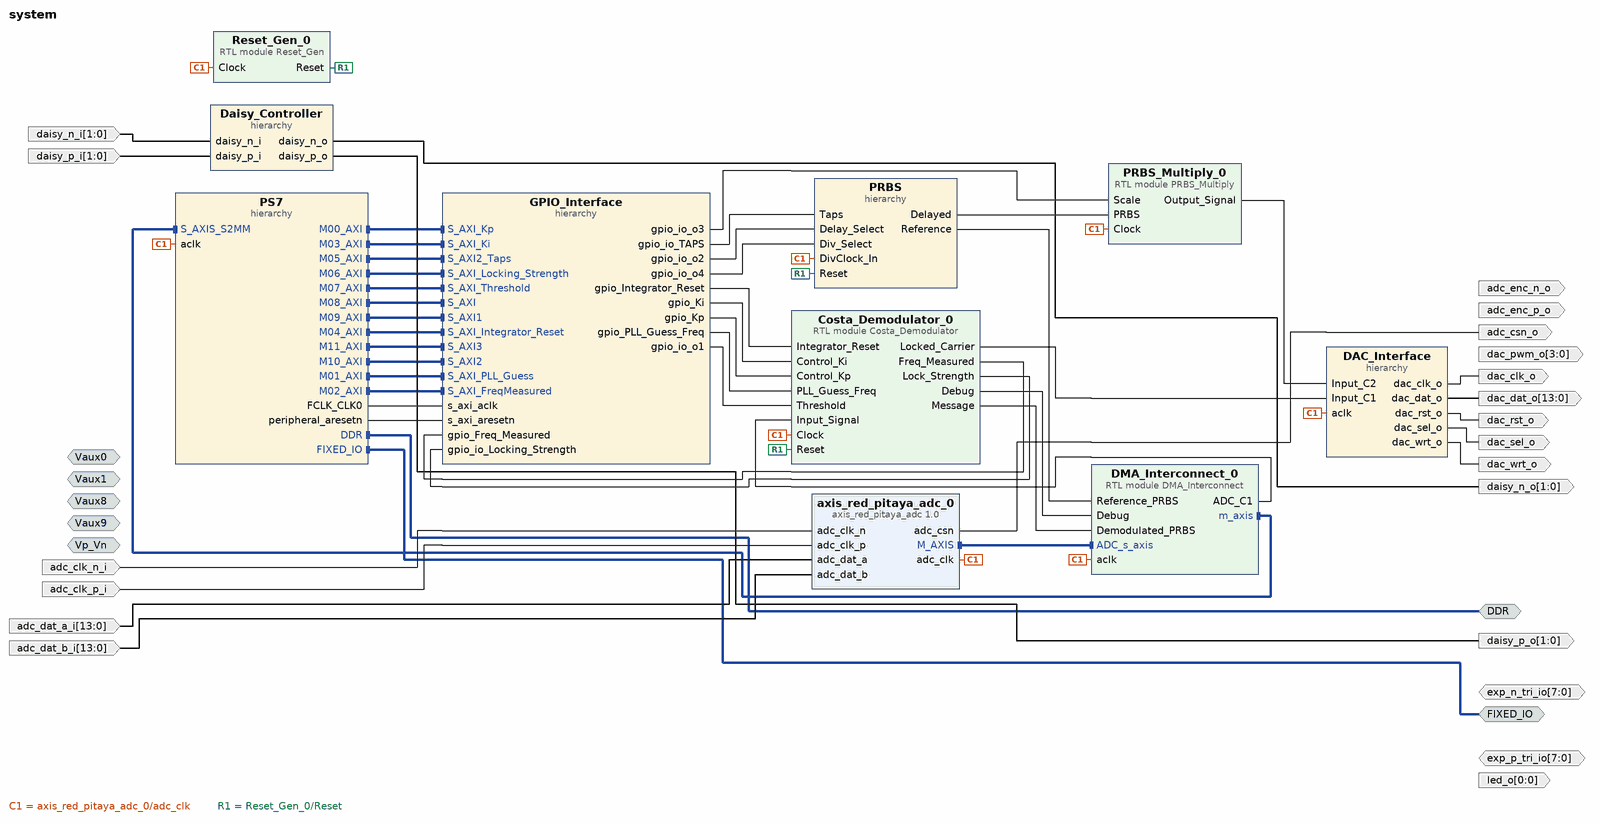
[diagram p0: block diagram of the top level]
# Vivado block design system, xc7z010clg400-1, Vivado 2022.2
create_bd_design system

create_bd_intf_port -mode Slave -vlnv xilinx.com:interface:diff_analog_io_rtl:1.0 Vp_Vn
create_bd_intf_port -mode Slave -vlnv xilinx.com:interface:diff_analog_io_rtl:1.0 Vaux0
create_bd_intf_port -mode Slave -vlnv xilinx.com:interface:diff_analog_io_rtl:1.0 Vaux1
create_bd_intf_port -mode Slave -vlnv xilinx.com:interface:diff_analog_io_rtl:1.0 Vaux9
create_bd_intf_port -mode Slave -vlnv xilinx.com:interface:diff_analog_io_rtl:1.0 Vaux8
create_bd_intf_port -mode Master -vlnv xilinx.com:interface:ddrx_rtl:1.0 DDR
create_bd_intf_port -mode Master -vlnv xilinx.com:display_processing_system7:fixedio_rtl:1.0 FIXED_IO
create_bd_port -dir I -from 13 -to 0 adc_dat_b_i
create_bd_port -dir I adc_clk_p_i
create_bd_port -dir I adc_clk_n_i
create_bd_port -dir O adc_enc_p_o
create_bd_port -dir O adc_enc_n_o
create_bd_port -dir O adc_csn_o
create_bd_port -dir O -from 13 -to 0 dac_dat_o
create_bd_port -dir O dac_clk_o
create_bd_port -dir O dac_rst_o
create_bd_port -dir O dac_sel_o
create_bd_port -dir O dac_wrt_o
create_bd_port -dir O -from 3 -to 0 dac_pwm_o
create_bd_port -dir IO -from 7 -to 0 exp_p_tri_io
create_bd_port -dir IO -from 7 -to 0 exp_n_tri_io
create_bd_port -dir O -from 1 -to 0 daisy_p_o
create_bd_port -dir O -from 1 -to 0 daisy_n_o
create_bd_port -dir I -from 1 -to 0 daisy_p_i
create_bd_port -dir I -from 1 -to 0 daisy_n_i
create_bd_port -dir O -from 0 -to 0 led_o
create_bd_port -dir I -from 13 -to 0 adc_dat_a_i

create_bd_cell -type hier PS7
create_bd_cell -type hier Daisy_Controller
create_bd_cell -type ip -vlnv pavel-demin:user:axis_red_pitaya_adc:1.0 axis_red_pitaya_adc_0
create_bd_cell -type hier DAC_Interface
create_bd_cell -type hier GPIO_Interface
create_bd_cell -type hier PRBS
create_bd_cell -type module -reference DMA_Interconnect DMA_Interconnect_0
create_bd_cell -type module -reference PRBS_Multiply PRBS_Multiply_0
create_bd_cell -type module -reference Reset_Gen Reset_Gen_0
create_bd_cell -type module -reference Costa_Demodulator Costa_Demodulator_0
set_property -dict {CONFIG.RAM_Size 12} [get_bd_cells Costa_Demodulator_0]

# ---- hierarchy /PS7 ----
current_bd_instance /PS7
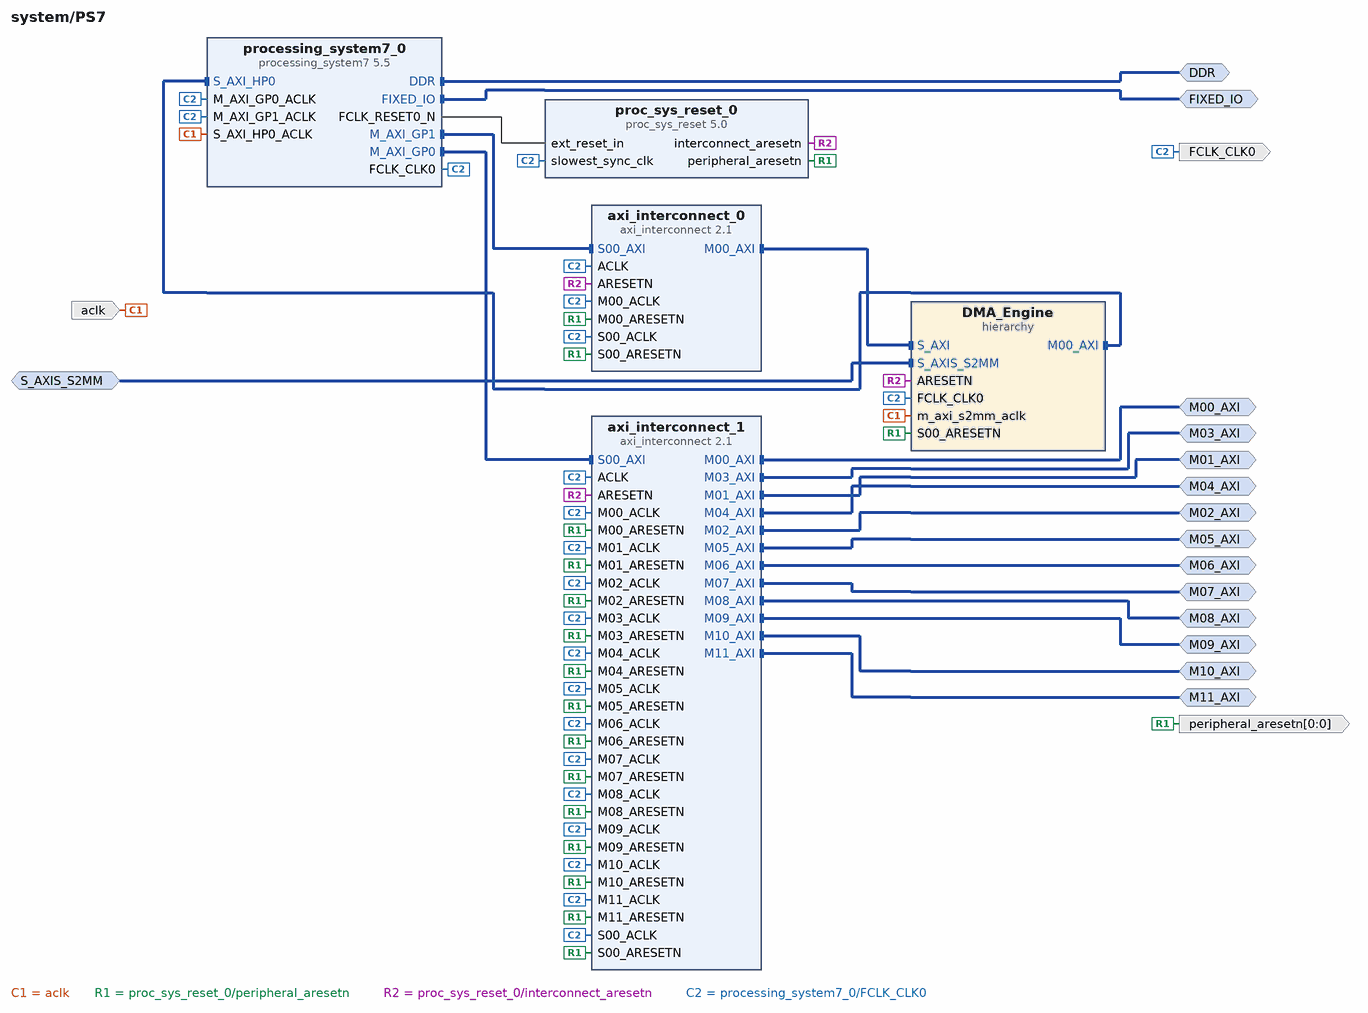
[diagram p1: block diagram inside /PS7]
create_bd_intf_pin -mode Master -vlnv xilinx.com:interface:ddrx_rtl:1.0 DDR
create_bd_intf_pin -mode Master -vlnv xilinx.com:display_processing_system7:fixedio_rtl:1.0 FIXED_IO
create_bd_intf_pin -mode Master -vlnv xilinx.com:interface:aximm_rtl:1.0 M03_AXI
create_bd_intf_pin -mode Master -vlnv xilinx.com:interface:aximm_rtl:1.0 M00_AXI
create_bd_intf_pin -mode Master -vlnv xilinx.com:interface:aximm_rtl:1.0 M01_AXI
create_bd_intf_pin -mode Master -vlnv xilinx.com:interface:aximm_rtl:1.0 M02_AXI
create_bd_intf_pin -mode Slave -vlnv xilinx.com:interface:axis_rtl:1.0 S_AXIS_S2MM
create_bd_intf_pin -mode Master -vlnv xilinx.com:interface:aximm_rtl:1.0 M04_AXI
create_bd_intf_pin -mode Master -vlnv xilinx.com:interface:aximm_rtl:1.0 M05_AXI
create_bd_intf_pin -mode Master -vlnv xilinx.com:interface:aximm_rtl:1.0 M06_AXI
create_bd_intf_pin -mode Master -vlnv xilinx.com:interface:aximm_rtl:1.0 M07_AXI
create_bd_intf_pin -mode Master -vlnv xilinx.com:interface:aximm_rtl:1.0 M08_AXI
create_bd_intf_pin -mode Master -vlnv xilinx.com:interface:aximm_rtl:1.0 M09_AXI
create_bd_intf_pin -mode Master -vlnv xilinx.com:interface:aximm_rtl:1.0 M10_AXI
create_bd_intf_pin -mode Master -vlnv xilinx.com:interface:aximm_rtl:1.0 M11_AXI
create_bd_pin -dir O -type clk FCLK_CLK0
create_bd_pin -dir O -from 0 -to 0 -type rst peripheral_aresetn
create_bd_pin -dir I -type clk aclk

create_bd_cell -type ip -vlnv xilinx.com:ip:processing_system7:5.5 processing_system7_0
set_property -dict [list \
  CONFIG.PCW_APU_PERIPHERAL_FREQMHZ 666.666666 \
  CONFIG.PCW_ENET0_ENET0_IO {MIO 16 .. 27} \
  CONFIG.PCW_ENET0_GRP_MDIO_ENABLE 1 \
  CONFIG.PCW_ENET0_GRP_MDIO_IO EMIO \
  CONFIG.PCW_ENET0_PERIPHERAL_ENABLE 1 \
  CONFIG.PCW_ENET0_RESET_ENABLE 0 \
  CONFIG.PCW_ENET_RESET_ENABLE 1 \
  CONFIG.PCW_ENET_RESET_SELECT {Share reset pin} \
  CONFIG.PCW_EN_CLK1_PORT 1 \
  CONFIG.PCW_EN_RST1_PORT 1 \
  CONFIG.PCW_FCLK1_PERIPHERAL_CLKSRC {DDR PLL} \
  CONFIG.PCW_FCLK_CLK1_BUF TRUE \
  CONFIG.PCW_FPGA0_PERIPHERAL_FREQMHZ 125 \
  CONFIG.PCW_FPGA1_PERIPHERAL_FREQMHZ 150 \
  CONFIG.PCW_FPGA3_PERIPHERAL_FREQMHZ 200 \
  CONFIG.PCW_FPGA_FCLK1_ENABLE 1 \
  CONFIG.PCW_GPIO_MIO_GPIO_ENABLE 1 \
  CONFIG.PCW_GPIO_MIO_GPIO_IO MIO \
  CONFIG.PCW_GPIO_PERIPHERAL_ENABLE 1 \
  CONFIG.PCW_I2C0_GRP_INT_ENABLE 0 \
  CONFIG.PCW_I2C0_I2C0_IO {MIO 50 .. 51} \
  CONFIG.PCW_I2C0_PERIPHERAL_ENABLE 1 \
  CONFIG.PCW_I2C_PERIPHERAL_FREQMHZ 111.111115 \
  CONFIG.PCW_I2C_RESET_ENABLE 1 \
  CONFIG.PCW_I2C_RESET_SELECT {Share reset pin} \
  CONFIG.PCW_IMPORT_BOARD_PRESET cfg/red_pitaya.xml \
  CONFIG.PCW_PRESET_BANK1_VOLTAGE {LVCMOS 2.5V} \
  CONFIG.PCW_QSPI_GRP_SINGLE_SS_ENABLE 1 \
  CONFIG.PCW_QSPI_GRP_SINGLE_SS_IO {MIO 1 .. 6} \
  CONFIG.PCW_QSPI_PERIPHERAL_ENABLE 1 \
  CONFIG.PCW_QSPI_PERIPHERAL_FREQMHZ 125 \
  CONFIG.PCW_QSPI_QSPI_IO {MIO 1 .. 6} \
  CONFIG.PCW_SD0_GRP_CD_ENABLE 1 \
  CONFIG.PCW_SD0_GRP_CD_IO {MIO 46} \
  CONFIG.PCW_SD0_GRP_WP_ENABLE 1 \
  CONFIG.PCW_SD0_GRP_WP_IO {MIO 47} \
  CONFIG.PCW_SD0_PERIPHERAL_ENABLE 1 \
  CONFIG.PCW_SD0_SD0_IO {MIO 40 .. 45} \
  CONFIG.PCW_SDIO_PERIPHERAL_FREQMHZ 100 \
  CONFIG.PCW_SINGLE_QSPI_DATA_MODE x4 \
  CONFIG.PCW_SPI0_PERIPHERAL_ENABLE 1 \
  CONFIG.PCW_SPI0_SPI0_IO EMIO \
  CONFIG.PCW_SPI1_PERIPHERAL_ENABLE 1 \
  CONFIG.PCW_SPI1_SPI1_IO {MIO 10 .. 15} \
  CONFIG.PCW_TTC0_PERIPHERAL_ENABLE 1 \
  CONFIG.PCW_TTC0_TTC0_IO EMIO \
  CONFIG.PCW_UART0_PERIPHERAL_ENABLE 1 \
  CONFIG.PCW_UART0_UART0_IO {MIO 14 .. 15} \
  CONFIG.PCW_UART1_PERIPHERAL_ENABLE 1 \
  CONFIG.PCW_UART1_UART1_IO {MIO 8 .. 9} \
  CONFIG.PCW_UART_PERIPHERAL_FREQMHZ 100 \
  CONFIG.PCW_UIPARAM_DDR_BUS_WIDTH {16 Bit} \
  CONFIG.PCW_UIPARAM_DDR_FREQ_MHZ 533.333333 \
  CONFIG.PCW_UIPARAM_DDR_PARTNO {MT41J256M16 RE-125} \
  CONFIG.PCW_USB0_PERIPHERAL_ENABLE 1 \
  CONFIG.PCW_USB0_RESET_ENABLE 1 \
  CONFIG.PCW_USB0_RESET_IO {MIO 48} \
  CONFIG.PCW_USB0_USB0_IO {MIO 28 .. 39} \
  CONFIG.PCW_USB_RESET_ENABLE 1 \
  CONFIG.PCW_USB_RESET_SELECT {Share reset pin} \
  CONFIG.PCW_USE_M_AXI_GP1 1 \
  CONFIG.PCW_USE_S_AXI_HP0 1 \
] [get_bd_cells processing_system7_0]
# 428 more settings of processing_system7_0 are not shown: defaults, MIO pin electricals, DDR timing, and values the tool derives
create_bd_cell -type ip -vlnv xilinx.com:ip:proc_sys_reset:5.0 proc_sys_reset_0
create_bd_cell -type ip -vlnv xilinx.com:ip:axi_interconnect:2.1 axi_interconnect_1
set_property -dict {CONFIG.NUM_MI 12 CONFIG.NUM_SI 1} [get_bd_cells axi_interconnect_1]
create_bd_cell -type hier DMA_Engine
create_bd_cell -type ip -vlnv xilinx.com:ip:axi_interconnect:2.1 axi_interconnect_0
set_property -dict {CONFIG.NUM_MI 1 CONFIG.NUM_SI 1} [get_bd_cells axi_interconnect_0]

# ---- hierarchy /PS7/DMA_Engine ----
current_bd_instance /PS7/DMA_Engine
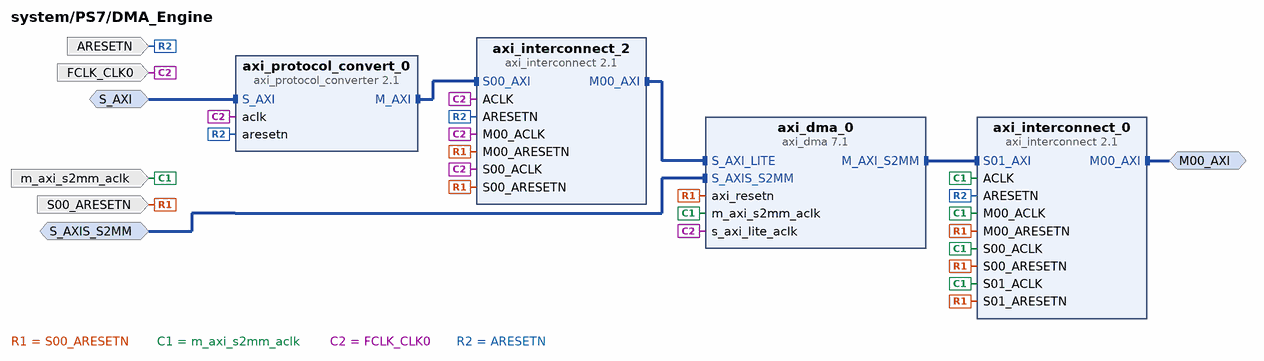
[diagram p2: block diagram inside /PS7/DMA_Engine]
create_bd_intf_pin -mode Slave -vlnv xilinx.com:interface:aximm_rtl:1.0 S_AXI
create_bd_intf_pin -mode Master -vlnv xilinx.com:interface:aximm_rtl:1.0 M00_AXI
create_bd_intf_pin -mode Slave -vlnv xilinx.com:interface:axis_rtl:1.0 S_AXIS_S2MM
create_bd_pin -dir I -type clk FCLK_CLK0
create_bd_pin -dir I -type clk m_axi_s2mm_aclk
create_bd_pin -dir I -type rst S00_ARESETN
create_bd_pin -dir I -type rst ARESETN

create_bd_cell -type ip -vlnv xilinx.com:ip:axi_dma:7.1 axi_dma_0
set_property -dict [list \
  CONFIG.c_include_mm2s 0 \
  CONFIG.c_include_sg 0 \
  CONFIG.c_s2mm_burst_size 256 \
  CONFIG.c_sg_length_width 26 \
] [get_bd_cells axi_dma_0]
create_bd_cell -type ip -vlnv xilinx.com:ip:axi_protocol_converter:2.1 axi_protocol_convert_0
create_bd_cell -type ip -vlnv xilinx.com:ip:axi_interconnect:2.1 axi_interconnect_2
set_property -dict {CONFIG.NUM_MI 1} [get_bd_cells axi_interconnect_2]
create_bd_cell -type ip -vlnv xilinx.com:ip:axi_interconnect:2.1 axi_interconnect_0
set_property -dict {CONFIG.NUM_MI 1 CONFIG.NUM_SI 2} [get_bd_cells axi_interconnect_0]

# ---- hierarchy /Daisy_Controller ----
current_bd_instance /Daisy_Controller
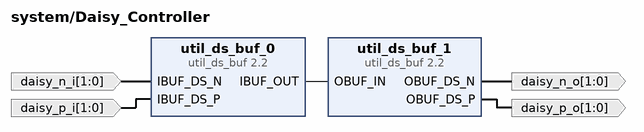
[diagram p3: block diagram inside /Daisy_Controller]
create_bd_pin -dir I -from 1 -to 0 daisy_p_i
create_bd_pin -dir I -from 1 -to 0 daisy_n_i
create_bd_pin -dir O -from 1 -to 0 -type clk daisy_p_o
create_bd_pin -dir O -from 1 -to 0 -type clk daisy_n_o

create_bd_cell -type ip -vlnv xilinx.com:ip:util_ds_buf:2.2 util_ds_buf_0
set_property -dict {CONFIG.C_SIZE 2} [get_bd_cells util_ds_buf_0]
create_bd_cell -type ip -vlnv xilinx.com:ip:util_ds_buf:2.2 util_ds_buf_1
set_property -dict {CONFIG.C_BUF_TYPE OBUFDS CONFIG.C_SIZE 2} [get_bd_cells util_ds_buf_1]

# ---- hierarchy /DAC_Interface ----
current_bd_instance /DAC_Interface
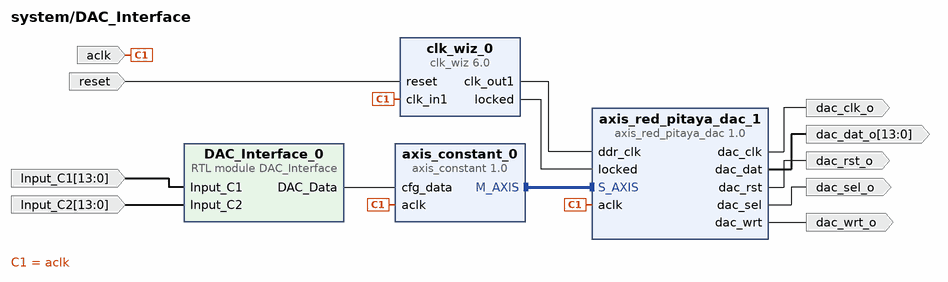
[diagram p4: block diagram inside /DAC_Interface]
create_bd_pin -dir I -type clk aclk
create_bd_pin -dir I -type rst reset
create_bd_pin -dir O -type clk dac_clk_o
create_bd_pin -dir O -type rst dac_rst_o
create_bd_pin -dir O dac_sel_o
create_bd_pin -dir O dac_wrt_o
create_bd_pin -dir O -from 13 -to 0 dac_dat_o
create_bd_pin -dir I -from 13 -to 0 Input_C1
create_bd_pin -dir I -from 13 -to 0 Input_C2

create_bd_cell -type ip -vlnv pavel-demin:user:axis_constant:1.0 axis_constant_0
set_property -dict {CONFIG.AXIS_TDATA_WIDTH 32} [get_bd_cells axis_constant_0]
create_bd_cell -type ip -vlnv xilinx.com:ip:clk_wiz:6.0 clk_wiz_0
set_property -dict [list \
  CONFIG.CLKOUT1_JITTER 104.759 \
  CONFIG.CLKOUT1_REQUESTED_OUT_FREQ 250 \
  CONFIG.MMCM_CLKOUT0_DIVIDE_F 4.000 \
] [get_bd_cells clk_wiz_0]
create_bd_cell -type ip -vlnv pavel-demin:user:axis_red_pitaya_dac:1.0 axis_red_pitaya_dac_1
create_bd_cell -type module -reference DAC_Interface DAC_Interface_0

# ---- hierarchy /GPIO_Interface ----
current_bd_instance /GPIO_Interface
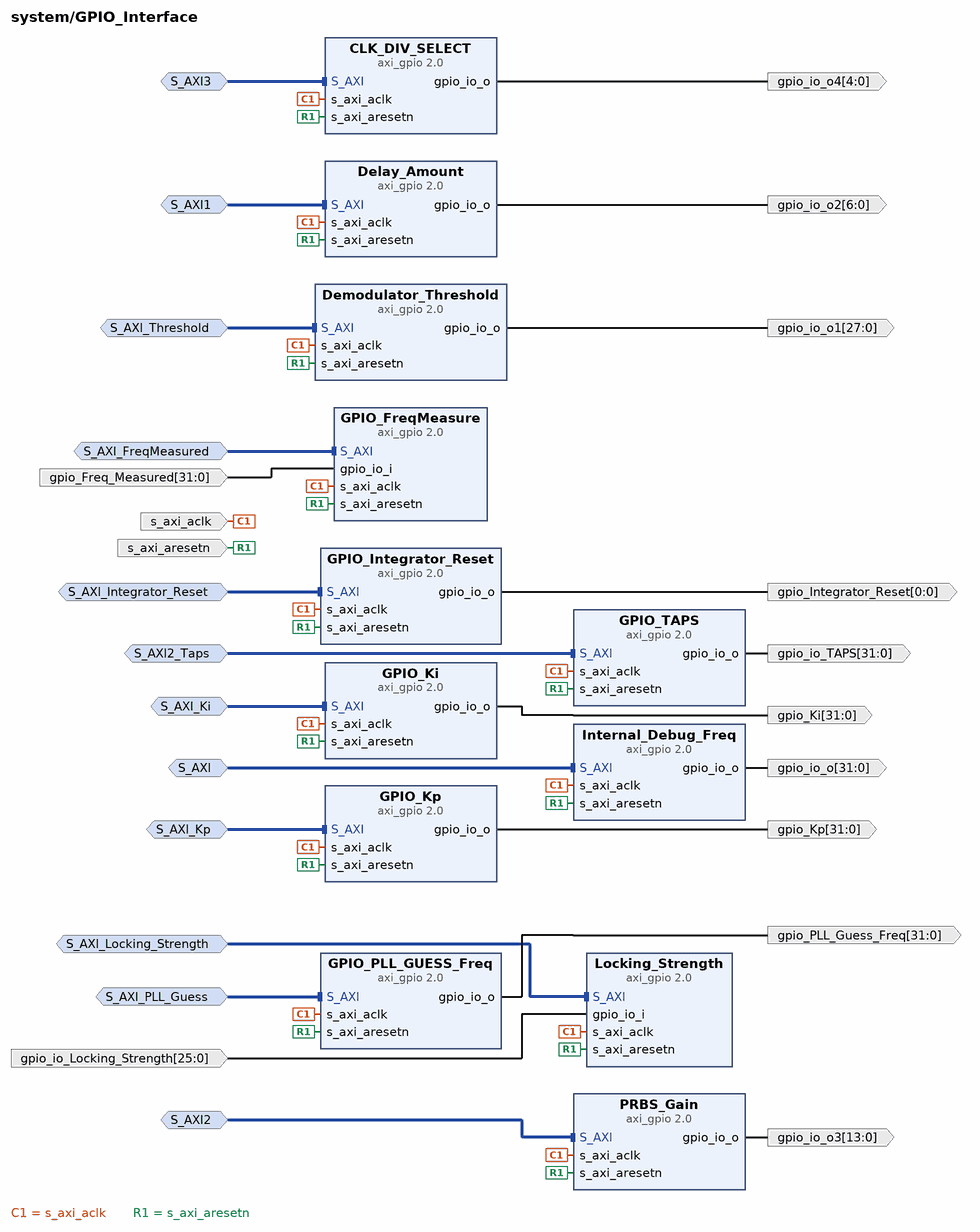
[diagram p5: block diagram inside /GPIO_Interface]
create_bd_intf_pin -mode Slave -vlnv xilinx.com:interface:aximm_rtl:1.0 S_AXI_Ki
create_bd_intf_pin -mode Slave -vlnv xilinx.com:interface:aximm_rtl:1.0 S_AXI_Kp
create_bd_intf_pin -mode Slave -vlnv xilinx.com:interface:aximm_rtl:1.0 S_AXI_PLL_Guess
create_bd_intf_pin -mode Slave -vlnv xilinx.com:interface:aximm_rtl:1.0 S_AXI_FreqMeasured
create_bd_intf_pin -mode Slave -vlnv xilinx.com:interface:aximm_rtl:1.0 S_AXI_Integrator_Reset
create_bd_intf_pin -mode Slave -vlnv xilinx.com:interface:aximm_rtl:1.0 S_AXI_Locking_Strength
create_bd_intf_pin -mode Slave -vlnv xilinx.com:interface:aximm_rtl:1.0 S_AXI2_Taps
create_bd_intf_pin -mode Slave -vlnv xilinx.com:interface:aximm_rtl:1.0 S_AXI_Threshold
create_bd_intf_pin -mode Slave -vlnv xilinx.com:interface:aximm_rtl:1.0 S_AXI
create_bd_intf_pin -mode Slave -vlnv xilinx.com:interface:aximm_rtl:1.0 S_AXI1
create_bd_intf_pin -mode Slave -vlnv xilinx.com:interface:aximm_rtl:1.0 S_AXI2
create_bd_intf_pin -mode Slave -vlnv xilinx.com:interface:aximm_rtl:1.0 S_AXI3
create_bd_pin -dir O -from 31 -to 0 gpio_Ki
create_bd_pin -dir O -from 31 -to 0 gpio_Kp
create_bd_pin -dir O -from 31 -to 0 gpio_PLL_Guess_Freq
create_bd_pin -dir I -type clk s_axi_aclk
create_bd_pin -dir I -type rst s_axi_aresetn
create_bd_pin -dir I -from 31 -to 0 gpio_Freq_Measured
create_bd_pin -dir O -from 0 -to 0 gpio_Integrator_Reset
create_bd_pin -dir I -from 25 -to 0 gpio_io_Locking_Strength
create_bd_pin -dir O -from 31 -to 0 gpio_io_TAPS
create_bd_pin -dir O -from 31 -to 0 gpio_io_o
create_bd_pin -dir O -from 27 -to 0 gpio_io_o1
create_bd_pin -dir O -from 6 -to 0 gpio_io_o2
create_bd_pin -dir O -from 13 -to 0 gpio_io_o3
create_bd_pin -dir O -from 4 -to 0 gpio_io_o4

create_bd_cell -type ip -vlnv xilinx.com:ip:axi_gpio:2.0 GPIO_Ki
set_property -dict {CONFIG.C_ALL_OUTPUTS 1} [get_bd_cells GPIO_Ki]
create_bd_cell -type ip -vlnv xilinx.com:ip:axi_gpio:2.0 GPIO_Kp
set_property -dict {CONFIG.C_ALL_OUTPUTS 1} [get_bd_cells GPIO_Kp]
create_bd_cell -type ip -vlnv xilinx.com:ip:axi_gpio:2.0 GPIO_PLL_GUESS_Freq
set_property -dict {CONFIG.C_ALL_OUTPUTS 1} [get_bd_cells GPIO_PLL_GUESS_Freq]
create_bd_cell -type ip -vlnv xilinx.com:ip:axi_gpio:2.0 GPIO_FreqMeasure
set_property -dict {CONFIG.C_ALL_INPUTS 1} [get_bd_cells GPIO_FreqMeasure]
create_bd_cell -type ip -vlnv xilinx.com:ip:axi_gpio:2.0 GPIO_Integrator_Reset
set_property -dict {CONFIG.C_ALL_OUTPUTS 1 CONFIG.C_GPIO_WIDTH 1} [get_bd_cells GPIO_Integrator_Reset]
create_bd_cell -type ip -vlnv xilinx.com:ip:axi_gpio:2.0 Locking_Strength
set_property -dict {CONFIG.C_ALL_INPUTS 1 CONFIG.C_GPIO_WIDTH 26} [get_bd_cells Locking_Strength]
create_bd_cell -type ip -vlnv xilinx.com:ip:axi_gpio:2.0 GPIO_TAPS
set_property -dict {CONFIG.C_ALL_OUTPUTS 1 CONFIG.C_GPIO_WIDTH 32 CONFIG.C_IS_DUAL 0} [get_bd_cells GPIO_TAPS]
create_bd_cell -type ip -vlnv xilinx.com:ip:axi_gpio:2.0 Internal_Debug_Freq
set_property -dict {CONFIG.C_ALL_INPUTS 0 CONFIG.C_ALL_OUTPUTS 1 CONFIG.C_GPIO_WIDTH 32} [get_bd_cells Internal_Debug_Freq]
create_bd_cell -type ip -vlnv xilinx.com:ip:axi_gpio:2.0 Demodulator_Threshold
set_property -dict {CONFIG.C_ALL_INPUTS 0 CONFIG.C_ALL_OUTPUTS 1 CONFIG.C_GPIO_WIDTH 28} [get_bd_cells Demodulator_Threshold]
create_bd_cell -type ip -vlnv xilinx.com:ip:axi_gpio:2.0 Delay_Amount
set_property -dict {CONFIG.C_ALL_INPUTS 0 CONFIG.C_ALL_OUTPUTS 1 CONFIG.C_GPIO_WIDTH 7} [get_bd_cells Delay_Amount]
create_bd_cell -type ip -vlnv xilinx.com:ip:axi_gpio:2.0 PRBS_Gain
set_property -dict {CONFIG.C_ALL_INPUTS 0 CONFIG.C_ALL_OUTPUTS 1 CONFIG.C_GPIO_WIDTH 14} [get_bd_cells PRBS_Gain]
create_bd_cell -type ip -vlnv xilinx.com:ip:axi_gpio:2.0 CLK_DIV_SELECT
set_property -dict {CONFIG.C_ALL_INPUTS 0 CONFIG.C_ALL_OUTPUTS 1 CONFIG.C_GPIO_WIDTH 5} [get_bd_cells CLK_DIV_SELECT]

# ---- hierarchy /PRBS ----
current_bd_instance /PRBS
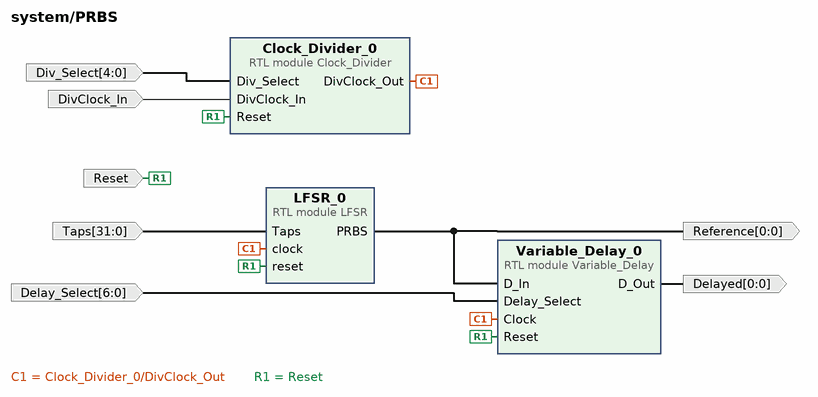
[diagram p6: block diagram inside /PRBS]
create_bd_pin -dir I -from 31 -to 0 Taps
create_bd_pin -dir O -from 0 -to 0 Reference
create_bd_pin -dir I -type rst Reset
create_bd_pin -dir I DivClock_In
create_bd_pin -dir O -from 0 -to 0 Delayed
create_bd_pin -dir I -from 6 -to 0 Delay_Select
create_bd_pin -dir I -from 4 -to 0 Div_Select

create_bd_cell -type module -reference LFSR LFSR_0
set_property -dict {CONFIG.Size 10} [get_bd_cells LFSR_0]
create_bd_cell -type module -reference Clock_Divider Clock_Divider_0
create_bd_cell -type module -reference Variable_Delay Variable_Delay_0
set_property -dict {CONFIG.Bus_Size 1 CONFIG.Delay_Select_Bits 7} [get_bd_cells Variable_Delay_0]

# ---- connections ----

current_bd_instance /PS7
connect_bd_intf_net [get_bd_intf_pins M03_AXI] [get_bd_intf_pins axi_interconnect_1/M03_AXI]
connect_bd_intf_net [get_bd_intf_pins M04_AXI] [get_bd_intf_pins axi_interconnect_1/M04_AXI]
connect_bd_intf_net [get_bd_intf_pins M05_AXI] [get_bd_intf_pins axi_interconnect_1/M05_AXI]
connect_bd_intf_net [get_bd_intf_pins M00_AXI] [get_bd_intf_pins axi_interconnect_1/M00_AXI]
connect_bd_intf_net [get_bd_intf_pins M01_AXI] [get_bd_intf_pins axi_interconnect_1/M01_AXI]
connect_bd_intf_net [get_bd_intf_pins M02_AXI] [get_bd_intf_pins axi_interconnect_1/M02_AXI]
connect_bd_intf_net [get_bd_intf_pins S_AXIS_S2MM] [get_bd_intf_pins DMA_Engine/S_AXIS_S2MM]
connect_bd_intf_net [get_bd_intf_pins axi_interconnect_0/S00_AXI] [get_bd_intf_pins processing_system7_0/M_AXI_GP1]
connect_bd_intf_net -intf_net axi_interconnect_0_M00_AXI [get_bd_intf_pins DMA_Engine/M00_AXI] [get_bd_intf_pins processing_system7_0/S_AXI_HP0]
connect_bd_intf_net [get_bd_intf_pins axi_interconnect_0/M00_AXI] [get_bd_intf_pins DMA_Engine/S_AXI]
connect_bd_intf_net [get_bd_intf_pins M06_AXI] [get_bd_intf_pins axi_interconnect_1/M06_AXI]
connect_bd_intf_net [get_bd_intf_pins M07_AXI] [get_bd_intf_pins axi_interconnect_1/M07_AXI]
connect_bd_intf_net [get_bd_intf_pins M08_AXI] [get_bd_intf_pins axi_interconnect_1/M08_AXI]
connect_bd_intf_net [get_bd_intf_pins M09_AXI] [get_bd_intf_pins axi_interconnect_1/M09_AXI]
connect_bd_intf_net [get_bd_intf_pins M10_AXI] [get_bd_intf_pins axi_interconnect_1/M10_AXI]
connect_bd_intf_net [get_bd_intf_pins M11_AXI] [get_bd_intf_pins axi_interconnect_1/M11_AXI]
connect_bd_intf_net [get_bd_intf_pins DDR] [get_bd_intf_pins processing_system7_0/DDR]
connect_bd_intf_net [get_bd_intf_pins FIXED_IO] [get_bd_intf_pins processing_system7_0/FIXED_IO]
connect_bd_intf_net [get_bd_intf_pins processing_system7_0/M_AXI_GP0] [get_bd_intf_pins axi_interconnect_1/S00_AXI]
connect_bd_net [get_bd_pins aclk] [get_bd_pins processing_system7_0/S_AXI_HP0_ACLK] [get_bd_pins DMA_Engine/m_axi_s2mm_aclk]
connect_bd_net -net S00_ARESETN_1 [get_bd_pins proc_sys_reset_0/peripheral_aresetn] \
  [get_bd_pins peripheral_aresetn] [get_bd_pins axi_interconnect_1/M00_ARESETN] [get_bd_pins axi_interconnect_1/M03_ARESETN] \
  [get_bd_pins axi_interconnect_1/M01_ARESETN] [get_bd_pins axi_interconnect_1/M02_ARESETN] \
  [get_bd_pins axi_interconnect_1/S00_ARESETN] [get_bd_pins axi_interconnect_1/M04_ARESETN] \
  [get_bd_pins axi_interconnect_1/M05_ARESETN] [get_bd_pins DMA_Engine/S00_ARESETN] \
  [get_bd_pins axi_interconnect_0/M00_ARESETN] [get_bd_pins axi_interconnect_0/S00_ARESETN] \
  [get_bd_pins axi_interconnect_1/M06_ARESETN] [get_bd_pins axi_interconnect_1/M07_ARESETN] \
  [get_bd_pins axi_interconnect_1/M08_ARESETN] [get_bd_pins axi_interconnect_1/M09_ARESETN] \
  [get_bd_pins axi_interconnect_1/M10_ARESETN] [get_bd_pins axi_interconnect_1/M11_ARESETN]
connect_bd_net [get_bd_pins proc_sys_reset_0/interconnect_aresetn] \
  [get_bd_pins axi_interconnect_1/ARESETN] [get_bd_pins axi_interconnect_0/ARESETN] [get_bd_pins DMA_Engine/ARESETN]
connect_bd_net [get_bd_pins processing_system7_0/FCLK_CLK0] \
  [get_bd_pins FCLK_CLK0] [get_bd_pins processing_system7_0/M_AXI_GP1_ACLK] [get_bd_pins axi_interconnect_1/ACLK] \
  [get_bd_pins axi_interconnect_1/S00_ACLK] [get_bd_pins axi_interconnect_1/M00_ACLK] \
  [get_bd_pins axi_interconnect_1/M01_ACLK] [get_bd_pins axi_interconnect_1/M02_ACLK] \
  [get_bd_pins axi_interconnect_1/M03_ACLK] [get_bd_pins processing_system7_0/M_AXI_GP0_ACLK] \
  [get_bd_pins proc_sys_reset_0/slowest_sync_clk] [get_bd_pins DMA_Engine/FCLK_CLK0] \
  [get_bd_pins axi_interconnect_1/M04_ACLK] [get_bd_pins axi_interconnect_1/M05_ACLK] [get_bd_pins axi_interconnect_0/ACLK] \
  [get_bd_pins axi_interconnect_0/S00_ACLK] [get_bd_pins axi_interconnect_0/M00_ACLK] \
  [get_bd_pins axi_interconnect_1/M06_ACLK] [get_bd_pins axi_interconnect_1/M07_ACLK] \
  [get_bd_pins axi_interconnect_1/M08_ACLK] [get_bd_pins axi_interconnect_1/M09_ACLK] \
  [get_bd_pins axi_interconnect_1/M10_ACLK] [get_bd_pins axi_interconnect_1/M11_ACLK]
connect_bd_net [get_bd_pins processing_system7_0/FCLK_RESET0_N] [get_bd_pins proc_sys_reset_0/ext_reset_in]

current_bd_instance /PS7/DMA_Engine
connect_bd_intf_net [get_bd_intf_pins S_AXIS_S2MM] [get_bd_intf_pins axi_dma_0/S_AXIS_S2MM]
connect_bd_intf_net [get_bd_intf_pins axi_dma_0/M_AXI_S2MM] [get_bd_intf_pins axi_interconnect_0/S01_AXI]
connect_bd_intf_net [get_bd_intf_pins M00_AXI] [get_bd_intf_pins axi_interconnect_0/M00_AXI]
connect_bd_intf_net [get_bd_intf_pins axi_interconnect_2/M00_AXI] [get_bd_intf_pins axi_dma_0/S_AXI_LITE]
connect_bd_intf_net [get_bd_intf_pins axi_protocol_convert_0/M_AXI] [get_bd_intf_pins axi_interconnect_2/S00_AXI]
connect_bd_intf_net -intf_net processing_system7_0_M_AXI_GP1 [get_bd_intf_pins S_AXI] [get_bd_intf_pins axi_protocol_convert_0/S_AXI]
connect_bd_net -net ARESETN_1 [get_bd_pins S00_ARESETN] \
  [get_bd_pins axi_interconnect_0/S00_ARESETN] [get_bd_pins axi_interconnect_0/M00_ARESETN] \
  [get_bd_pins axi_interconnect_0/S01_ARESETN] [get_bd_pins axi_interconnect_2/M00_ARESETN] \
  [get_bd_pins axi_interconnect_2/S00_ARESETN] [get_bd_pins axi_dma_0/axi_resetn]
connect_bd_net [get_bd_pins m_axi_s2mm_aclk] \
  [get_bd_pins axi_dma_0/m_axi_s2mm_aclk] [get_bd_pins axi_interconnect_0/ACLK] [get_bd_pins axi_interconnect_0/S00_ACLK] \
  [get_bd_pins axi_interconnect_0/M00_ACLK] [get_bd_pins axi_interconnect_0/S01_ACLK]
connect_bd_net -net processing_system7_0_FCLK_CLK0 [get_bd_pins FCLK_CLK0] \
  [get_bd_pins axi_interconnect_2/S00_ACLK] [get_bd_pins axi_interconnect_2/M00_ACLK] \
  [get_bd_pins axi_protocol_convert_0/aclk] [get_bd_pins axi_dma_0/s_axi_lite_aclk] [get_bd_pins axi_interconnect_2/ACLK]
connect_bd_net -net processing_system7_0_FCLK_RESET0_N [get_bd_pins ARESETN] \
  [get_bd_pins axi_interconnect_2/ARESETN] [get_bd_pins axi_interconnect_0/ARESETN] \
  [get_bd_pins axi_protocol_convert_0/aresetn]

current_bd_instance /Daisy_Controller
connect_bd_net [get_bd_pins daisy_n_i] [get_bd_pins util_ds_buf_0/IBUF_DS_N]
connect_bd_net [get_bd_pins daisy_p_i] [get_bd_pins util_ds_buf_0/IBUF_DS_P]
connect_bd_net [get_bd_pins util_ds_buf_0/IBUF_OUT] [get_bd_pins util_ds_buf_1/OBUF_IN]
connect_bd_net [get_bd_pins util_ds_buf_1/OBUF_DS_N] [get_bd_pins daisy_n_o]
connect_bd_net [get_bd_pins util_ds_buf_1/OBUF_DS_P] [get_bd_pins daisy_p_o]

current_bd_instance /DAC_Interface
connect_bd_intf_net [get_bd_intf_pins axis_red_pitaya_dac_1/S_AXIS] [get_bd_intf_pins axis_constant_0/M_AXIS]
connect_bd_net -net Custom_System_0_Reset [get_bd_pins reset] [get_bd_pins clk_wiz_0/reset]
connect_bd_net [get_bd_pins DAC_Interface_0/DAC_Data] [get_bd_pins axis_constant_0/cfg_data]
connect_bd_net -net Input_C1_1 [get_bd_pins Input_C1] [get_bd_pins DAC_Interface_0/Input_C1]
connect_bd_net -net Input_C2_1 [get_bd_pins Input_C2] [get_bd_pins DAC_Interface_0/Input_C2]
connect_bd_net [get_bd_pins aclk] [get_bd_pins axis_red_pitaya_dac_1/aclk] [get_bd_pins clk_wiz_0/clk_in1] [get_bd_pins axis_constant_0/aclk]
connect_bd_net [get_bd_pins axis_red_pitaya_dac_1/dac_clk] [get_bd_pins dac_clk_o]
connect_bd_net [get_bd_pins axis_red_pitaya_dac_1/dac_dat] [get_bd_pins dac_dat_o]
connect_bd_net [get_bd_pins axis_red_pitaya_dac_1/dac_rst] [get_bd_pins dac_rst_o]
connect_bd_net [get_bd_pins axis_red_pitaya_dac_1/dac_sel] [get_bd_pins dac_sel_o]
connect_bd_net [get_bd_pins axis_red_pitaya_dac_1/dac_wrt] [get_bd_pins dac_wrt_o]
connect_bd_net [get_bd_pins clk_wiz_0/clk_out1] [get_bd_pins axis_red_pitaya_dac_1/ddr_clk]
connect_bd_net [get_bd_pins clk_wiz_0/locked] [get_bd_pins axis_red_pitaya_dac_1/locked]

current_bd_instance /GPIO_Interface
connect_bd_intf_net [get_bd_intf_pins S_AXI2_Taps] [get_bd_intf_pins GPIO_TAPS/S_AXI]
connect_bd_intf_net -intf_net PS7_M00_AXI [get_bd_intf_pins S_AXI_PLL_Guess] [get_bd_intf_pins GPIO_PLL_GUESS_Freq/S_AXI]
connect_bd_intf_net -intf_net PS7_M04_AXI [get_bd_intf_pins S_AXI_Kp] [get_bd_intf_pins GPIO_Kp/S_AXI]
connect_bd_intf_net -intf_net PS7_M05_AXI [get_bd_intf_pins S_AXI_Ki] [get_bd_intf_pins GPIO_Ki/S_AXI]
connect_bd_intf_net -intf_net S_AXI10_1 [get_bd_intf_pins S_AXI_Integrator_Reset] [get_bd_intf_pins GPIO_Integrator_Reset/S_AXI]
connect_bd_intf_net -intf_net S_AXI1_1 [get_bd_intf_pins S_AXI1] [get_bd_intf_pins Delay_Amount/S_AXI]
connect_bd_intf_net -intf_net S_AXI2_1 [get_bd_intf_pins S_AXI2] [get_bd_intf_pins PRBS_Gain/S_AXI]
connect_bd_intf_net -intf_net S_AXI3_1 [get_bd_intf_pins S_AXI3] [get_bd_intf_pins CLK_DIV_SELECT/S_AXI]
connect_bd_intf_net -intf_net S_AXI7_1 [get_bd_intf_pins S_AXI_FreqMeasured] [get_bd_intf_pins GPIO_FreqMeasure/S_AXI]
connect_bd_intf_net [get_bd_intf_pins S_AXI_Locking_Strength] [get_bd_intf_pins Locking_Strength/S_AXI]
connect_bd_intf_net [get_bd_intf_pins S_AXI_Threshold] [get_bd_intf_pins Demodulator_Threshold/S_AXI]
connect_bd_intf_net [get_bd_intf_pins S_AXI] [get_bd_intf_pins Internal_Debug_Freq/S_AXI]
connect_bd_net [get_bd_pins CLK_DIV_SELECT/gpio_io_o] [get_bd_pins gpio_io_o4]
connect_bd_net [get_bd_pins Delay_Amount/gpio_io_o] [get_bd_pins gpio_io_o2]
connect_bd_net [get_bd_pins Demodulator_Threshold/gpio_io_o] [get_bd_pins gpio_io_o1]
connect_bd_net [get_bd_pins GPIO_Integrator_Reset/gpio_io_o] [get_bd_pins gpio_Integrator_Reset]
connect_bd_net [get_bd_pins GPIO_Ki/gpio_io_o] [get_bd_pins gpio_Ki]
connect_bd_net [get_bd_pins GPIO_Kp/gpio_io_o] [get_bd_pins gpio_Kp]
connect_bd_net [get_bd_pins GPIO_PLL_GUESS_Freq/gpio_io_o] [get_bd_pins gpio_PLL_Guess_Freq]
connect_bd_net [get_bd_pins GPIO_TAPS/gpio_io_o] [get_bd_pins gpio_io_TAPS]
connect_bd_net [get_bd_pins Internal_Debug_Freq/gpio_io_o] [get_bd_pins gpio_io_o]
connect_bd_net [get_bd_pins s_axi_aclk] \
  [get_bd_pins GPIO_Ki/s_axi_aclk] [get_bd_pins GPIO_Kp/s_axi_aclk] [get_bd_pins GPIO_PLL_GUESS_Freq/s_axi_aclk] \
  [get_bd_pins GPIO_FreqMeasure/s_axi_aclk] [get_bd_pins GPIO_Integrator_Reset/s_axi_aclk] \
  [get_bd_pins Locking_Strength/s_axi_aclk] [get_bd_pins GPIO_TAPS/s_axi_aclk] [get_bd_pins Internal_Debug_Freq/s_axi_aclk] \
  [get_bd_pins Demodulator_Threshold/s_axi_aclk] [get_bd_pins Delay_Amount/s_axi_aclk] [get_bd_pins PRBS_Gain/s_axi_aclk] \
  [get_bd_pins CLK_DIV_SELECT/s_axi_aclk]
connect_bd_net [get_bd_pins s_axi_aresetn] \
  [get_bd_pins GPIO_PLL_GUESS_Freq/s_axi_aresetn] [get_bd_pins GPIO_Kp/s_axi_aresetn] [get_bd_pins GPIO_Ki/s_axi_aresetn] \
  [get_bd_pins GPIO_FreqMeasure/s_axi_aresetn] [get_bd_pins GPIO_Integrator_Reset/s_axi_aresetn] \
  [get_bd_pins Locking_Strength/s_axi_aresetn] [get_bd_pins GPIO_TAPS/s_axi_aresetn] \
  [get_bd_pins Internal_Debug_Freq/s_axi_aresetn] [get_bd_pins Demodulator_Threshold/s_axi_aresetn] \
  [get_bd_pins Delay_Amount/s_axi_aresetn] [get_bd_pins PRBS_Gain/s_axi_aresetn] [get_bd_pins CLK_DIV_SELECT/s_axi_aresetn]
connect_bd_net [get_bd_pins PRBS_Gain/gpio_io_o] [get_bd_pins gpio_io_o3]
connect_bd_net -net gpio_io_i_1 [get_bd_pins gpio_Freq_Measured] [get_bd_pins GPIO_FreqMeasure/gpio_io_i]
connect_bd_net -net gpio_io_i_2 [get_bd_pins gpio_io_Locking_Strength] [get_bd_pins Locking_Strength/gpio_io_i]

current_bd_instance /PRBS
connect_bd_net [get_bd_pins Clock_Divider_0/DivClock_Out] [get_bd_pins LFSR_0/clock] [get_bd_pins Variable_Delay_0/Clock]
connect_bd_net [get_bd_pins Div_Select] [get_bd_pins Clock_Divider_0/Div_Select]
connect_bd_net -net GPIO_Interface_gpio_io_o1 [get_bd_pins Taps] [get_bd_pins LFSR_0/Taps]
connect_bd_net -net GPIO_Interface_gpio_io_o3 [get_bd_pins Delay_Select] [get_bd_pins Variable_Delay_0/Delay_Select]
connect_bd_net [get_bd_pins LFSR_0/PRBS] [get_bd_pins Reference] [get_bd_pins Variable_Delay_0/D_In]
connect_bd_net [get_bd_pins DivClock_In] [get_bd_pins Clock_Divider_0/DivClock_In]
connect_bd_net -net Squared_Phase_Locked_0_Reset_Out [get_bd_pins Reset] \
  [get_bd_pins LFSR_0/reset] [get_bd_pins Clock_Divider_0/Reset] [get_bd_pins Variable_Delay_0/Reset]
connect_bd_net [get_bd_pins Variable_Delay_0/D_Out] [get_bd_pins Delayed]

current_bd_instance /
connect_bd_intf_net [get_bd_intf_pins DMA_Interconnect_0/m_axis] [get_bd_intf_pins PS7/S_AXIS_S2MM]
connect_bd_intf_net [get_bd_intf_pins PS7/M00_AXI] [get_bd_intf_pins GPIO_Interface/S_AXI_Kp]
connect_bd_intf_net [get_bd_intf_pins PS7/M03_AXI] [get_bd_intf_pins GPIO_Interface/S_AXI_Ki]
connect_bd_intf_net [get_bd_intf_pins PS7/M05_AXI] [get_bd_intf_pins GPIO_Interface/S_AXI2_Taps]
connect_bd_intf_net [get_bd_intf_pins PS7/M06_AXI] [get_bd_intf_pins GPIO_Interface/S_AXI_Locking_Strength]
connect_bd_intf_net [get_bd_intf_pins PS7/M07_AXI] [get_bd_intf_pins GPIO_Interface/S_AXI_Threshold]
connect_bd_intf_net [get_bd_intf_pins PS7/M08_AXI] [get_bd_intf_pins GPIO_Interface/S_AXI]
connect_bd_intf_net [get_bd_intf_pins PS7/M09_AXI] [get_bd_intf_pins GPIO_Interface/S_AXI1]
connect_bd_intf_net -intf_net PS7_M10_AXI [get_bd_intf_pins PS7/M04_AXI] [get_bd_intf_pins GPIO_Interface/S_AXI_Integrator_Reset]
connect_bd_intf_net [get_bd_intf_pins PS7/M11_AXI] [get_bd_intf_pins GPIO_Interface/S_AXI3]
connect_bd_intf_net -intf_net S_AXI2_1 [get_bd_intf_pins GPIO_Interface/S_AXI2] [get_bd_intf_pins PS7/M10_AXI]
connect_bd_intf_net -intf_net S_AXI6_1 [get_bd_intf_pins GPIO_Interface/S_AXI_PLL_Guess] [get_bd_intf_pins PS7/M01_AXI]
connect_bd_intf_net -intf_net S_AXI7_1 [get_bd_intf_pins GPIO_Interface/S_AXI_FreqMeasured] [get_bd_intf_pins PS7/M02_AXI]
connect_bd_intf_net [get_bd_intf_pins DMA_Interconnect_0/ADC_s_axis] [get_bd_intf_pins axis_red_pitaya_adc_0/M_AXIS]
connect_bd_intf_net -intf_net processing_system7_0_DDR [get_bd_intf_ports DDR] [get_bd_intf_pins PS7/DDR]
connect_bd_intf_net -intf_net processing_system7_0_FIXED_IO [get_bd_intf_ports FIXED_IO] [get_bd_intf_pins PS7/FIXED_IO]
connect_bd_net [get_bd_pins Costa_Demodulator_0/Debug] [get_bd_pins DMA_Interconnect_0/Debug]
connect_bd_net [get_bd_pins Costa_Demodulator_0/Freq_Measured] [get_bd_pins GPIO_Interface/gpio_Freq_Measured]
connect_bd_net [get_bd_pins Costa_Demodulator_0/Locked_Carrier] [get_bd_pins DAC_Interface/Input_C1]
connect_bd_net [get_bd_pins Costa_Demodulator_0/Message] [get_bd_pins DMA_Interconnect_0/Demodulated_PRBS]
connect_bd_net [get_bd_pins DMA_Interconnect_0/ADC_C1] [get_bd_pins Costa_Demodulator_0/Input_Signal]
connect_bd_net [get_bd_pins GPIO_Interface/gpio_Integrator_Reset] [get_bd_pins Costa_Demodulator_0/Integrator_Reset]
connect_bd_net [get_bd_pins GPIO_Interface/gpio_Ki] [get_bd_pins Costa_Demodulator_0/Control_Ki]
connect_bd_net [get_bd_pins GPIO_Interface/gpio_Kp] [get_bd_pins Costa_Demodulator_0/Control_Kp]
connect_bd_net [get_bd_pins GPIO_Interface/gpio_PLL_Guess_Freq] [get_bd_pins Costa_Demodulator_0/PLL_Guess_Freq]
connect_bd_net -net GPIO_Interface_gpio_io_o1 [get_bd_pins GPIO_Interface/gpio_io_TAPS] [get_bd_pins PRBS/Taps]
connect_bd_net [get_bd_pins GPIO_Interface/gpio_io_o1] [get_bd_pins Costa_Demodulator_0/Threshold]
connect_bd_net [get_bd_pins GPIO_Interface/gpio_io_o2] [get_bd_pins PRBS/Delay_Select]
connect_bd_net [get_bd_pins GPIO_Interface/gpio_io_o3] [get_bd_pins PRBS_Multiply_0/Scale]
connect_bd_net [get_bd_pins GPIO_Interface/gpio_io_o4] [get_bd_pins PRBS/Div_Select]
connect_bd_net -net LFSR_0_PRBS [get_bd_pins PRBS/Reference] [get_bd_pins DMA_Interconnect_0/Reference_PRBS]
connect_bd_net [get_bd_pins axis_red_pitaya_adc_0/adc_clk] \
  [get_bd_pins DAC_Interface/aclk] [get_bd_pins PS7/aclk] [get_bd_pins PRBS/DivClock_In] \
  [get_bd_pins DMA_Interconnect_0/aclk] [get_bd_pins PRBS_Multiply_0/Clock] [get_bd_pins Reset_Gen_0/Clock] \
  [get_bd_pins Costa_Demodulator_0/Clock]
connect_bd_net [get_bd_pins PRBS_Multiply_0/Output_Signal] [get_bd_pins DAC_Interface/Input_C2]
connect_bd_net [get_bd_pins PS7/FCLK_CLK0] [get_bd_pins GPIO_Interface/s_axi_aclk]
connect_bd_net [get_bd_pins PS7/peripheral_aresetn] [get_bd_pins GPIO_Interface/s_axi_aresetn]
connect_bd_net -net Squared_Phase_Locked_0_Reset_Out [get_bd_pins Reset_Gen_0/Reset] [get_bd_pins PRBS/Reset] [get_bd_pins Costa_Demodulator_0/Reset]
connect_bd_net -net Variable_Delay_0_D_Out [get_bd_pins PRBS/Delayed] [get_bd_pins PRBS_Multiply_0/PRBS]
connect_bd_net [get_bd_ports adc_clk_n_i] [get_bd_pins axis_red_pitaya_adc_0/adc_clk_n]
connect_bd_net [get_bd_ports adc_clk_p_i] [get_bd_pins axis_red_pitaya_adc_0/adc_clk_p]
connect_bd_net [get_bd_ports adc_dat_a_i] [get_bd_pins axis_red_pitaya_adc_0/adc_dat_a]
connect_bd_net [get_bd_ports adc_dat_b_i] [get_bd_pins axis_red_pitaya_adc_0/adc_dat_b]
connect_bd_net [get_bd_pins axis_red_pitaya_adc_0/adc_csn] [get_bd_ports adc_csn_o]
connect_bd_net -net axis_red_pitaya_dac_1_dac_clk [get_bd_pins DAC_Interface/dac_clk_o] [get_bd_ports dac_clk_o]
connect_bd_net -net axis_red_pitaya_dac_1_dac_dat [get_bd_pins DAC_Interface/dac_dat_o] [get_bd_ports dac_dat_o]
connect_bd_net -net axis_red_pitaya_dac_1_dac_rst [get_bd_pins DAC_Interface/dac_rst_o] [get_bd_ports dac_rst_o]
connect_bd_net -net axis_red_pitaya_dac_1_dac_sel [get_bd_pins DAC_Interface/dac_sel_o] [get_bd_ports dac_sel_o]
connect_bd_net -net axis_red_pitaya_dac_1_dac_wrt [get_bd_pins DAC_Interface/dac_wrt_o] [get_bd_ports dac_wrt_o]
connect_bd_net [get_bd_ports daisy_n_i] [get_bd_pins Daisy_Controller/daisy_n_i]
connect_bd_net [get_bd_ports daisy_p_i] [get_bd_pins Daisy_Controller/daisy_p_i]
connect_bd_net -net gpio_io_Locking_Strength_1 [get_bd_pins Costa_Demodulator_0/Lock_Strength] [get_bd_pins GPIO_Interface/gpio_io_Locking_Strength]
connect_bd_net -net util_ds_buf_1_OBUF_DS_N [get_bd_pins Daisy_Controller/daisy_n_o] [get_bd_ports daisy_n_o]
connect_bd_net -net util_ds_buf_1_OBUF_DS_P [get_bd_pins Daisy_Controller/daisy_p_o] [get_bd_ports daisy_p_o]

# ---- address map ----
assign_bd_address -offset 0x00000000 -range 512M -target_address_space [get_bd_addr_spaces PS7/DMA_Engine/axi_dma_0/Data_MM2S] [get_bd_addr_segs PS7/processing_system7_0/S_AXI_HP0/HP0_DDR_LOWOCM]
assign_bd_address -offset 0x00000000 -range 512M -target_address_space [get_bd_addr_spaces PS7/DMA_Engine/axi_dma_0/Data_S2MM] [get_bd_addr_segs PS7/processing_system7_0/S_AXI_HP0/HP0_DDR_LOWOCM]
assign_bd_address -offset 0x41200000 -range 64K -target_address_space [get_bd_addr_spaces PS7/processing_system7_0/Data] [get_bd_addr_segs GPIO_Interface/GPIO_FreqMeasure/S_AXI/Reg]
assign_bd_address -offset 0x41210000 -range 64K -target_address_space [get_bd_addr_spaces PS7/processing_system7_0/Data] [get_bd_addr_segs GPIO_Interface/GPIO_PLL_GUESS_Freq/S_AXI/Reg]
assign_bd_address -offset 0x41220000 -range 64K -target_address_space [get_bd_addr_spaces PS7/processing_system7_0/Data] [get_bd_addr_segs GPIO_Interface/GPIO_Kp/S_AXI/Reg]
assign_bd_address -offset 0x41230000 -range 64K -target_address_space [get_bd_addr_spaces PS7/processing_system7_0/Data] [get_bd_addr_segs GPIO_Interface/GPIO_Ki/S_AXI/Reg]
assign_bd_address -offset 0x41240000 -range 64K -target_address_space [get_bd_addr_spaces PS7/processing_system7_0/Data] [get_bd_addr_segs GPIO_Interface/GPIO_Integrator_Reset/S_AXI/Reg]
assign_bd_address -offset 0x41250000 -range 64K -target_address_space [get_bd_addr_spaces PS7/processing_system7_0/Data] [get_bd_addr_segs GPIO_Interface/GPIO_TAPS/S_AXI/Reg]
assign_bd_address -offset 0x41260000 -range 64K -target_address_space [get_bd_addr_spaces PS7/processing_system7_0/Data] [get_bd_addr_segs GPIO_Interface/Locking_Strength/S_AXI/Reg]
assign_bd_address -offset 0x41270000 -range 64K -target_address_space [get_bd_addr_spaces PS7/processing_system7_0/Data] [get_bd_addr_segs GPIO_Interface/Demodulator_Threshold/S_AXI/Reg]
assign_bd_address -offset 0x41280000 -range 64K -target_address_space [get_bd_addr_spaces PS7/processing_system7_0/Data] [get_bd_addr_segs GPIO_Interface/Internal_Debug_Freq/S_AXI/Reg]
assign_bd_address -offset 0x41290000 -range 64K -target_address_space [get_bd_addr_spaces PS7/processing_system7_0/Data] [get_bd_addr_segs GPIO_Interface/Delay_Amount/S_AXI/Reg]
assign_bd_address -offset 0x412A0000 -range 64K -target_address_space [get_bd_addr_spaces PS7/processing_system7_0/Data] [get_bd_addr_segs GPIO_Interface/PRBS_Gain/S_AXI/Reg]
assign_bd_address -offset 0x412B0000 -range 64K -target_address_space [get_bd_addr_spaces PS7/processing_system7_0/Data] [get_bd_addr_segs GPIO_Interface/CLK_DIV_SELECT/S_AXI/Reg]
assign_bd_address -offset 0x80400000 -range 64K -target_address_space [get_bd_addr_spaces PS7/processing_system7_0/Data] [get_bd_addr_segs PS7/DMA_Engine/axi_dma_0/S_AXI_LITE/Reg]

validate_bd_design
save_bd_design
